# EAGLE design RotaryEncoder (EAGLE 7.2.0)
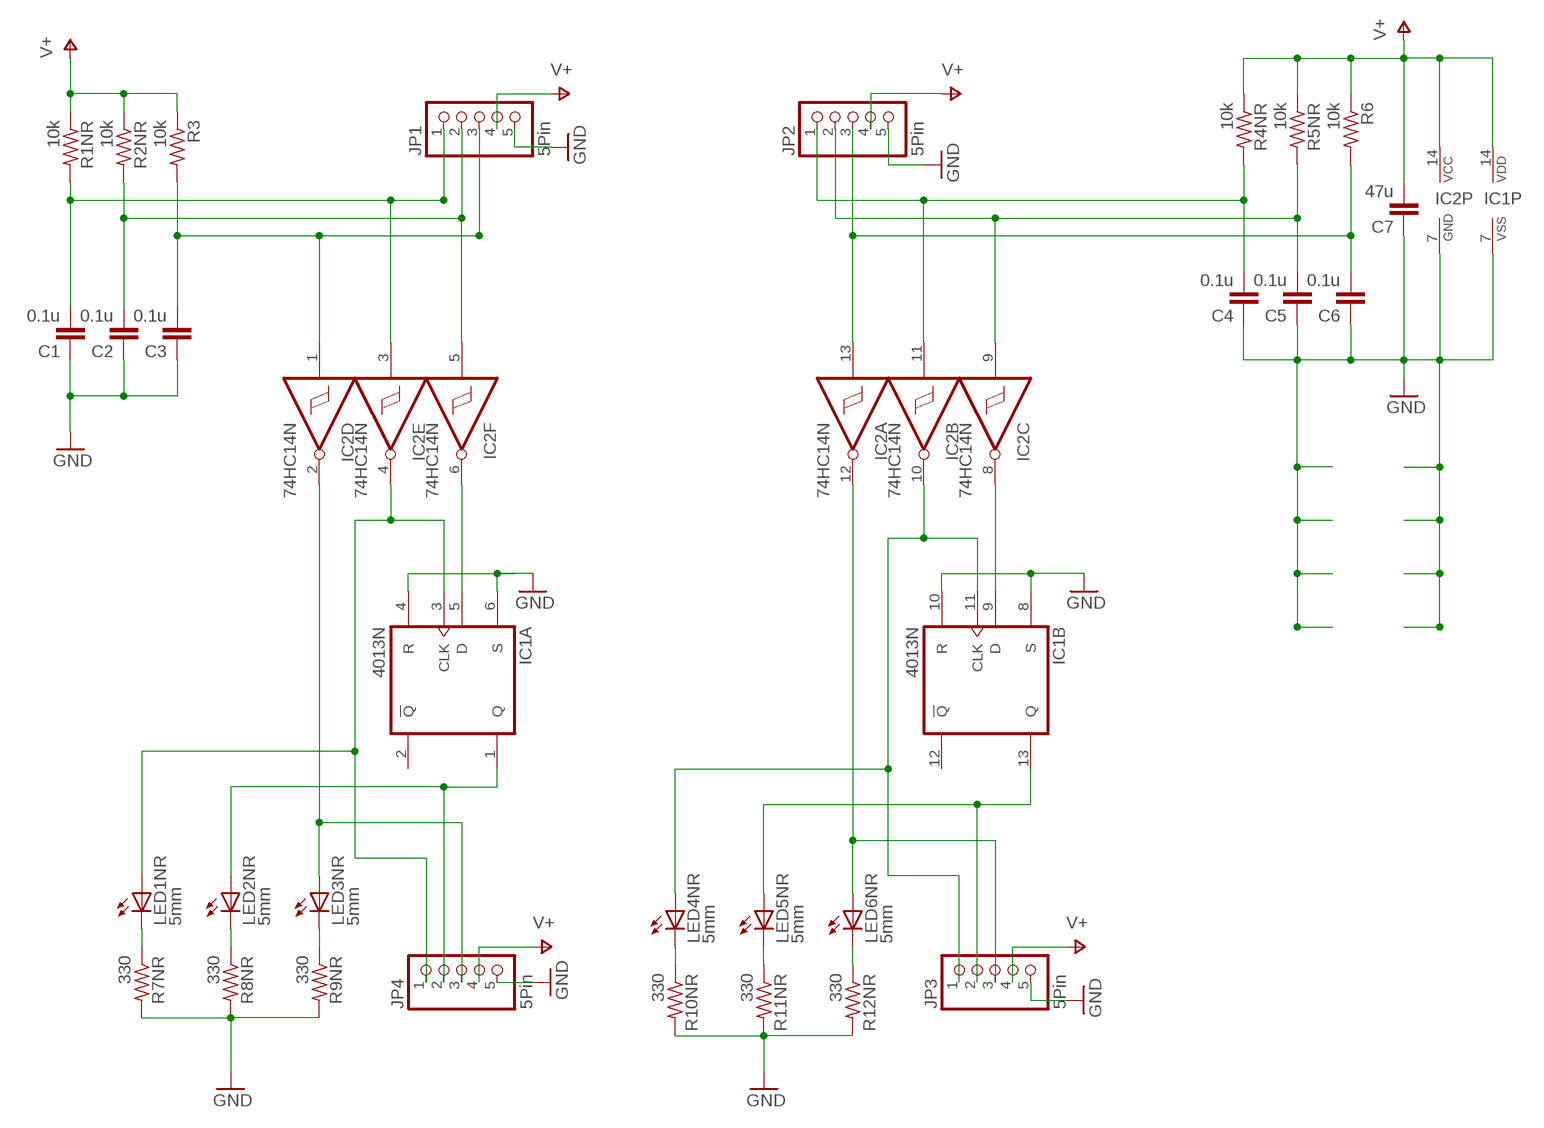
[diagram p0: schematic, sheet 1]

## Parts
C1  0.1u  C7.5/3  [C7.5B3]
C2  0.1u  C7.5/3  [C7.5B3]
C3  0.1u  C7.5/3  [C7.5B3]
C4  0.1u  C7.5/3  [C7.5B3]
C5  0.1u  C7.5/3  [C7.5B3]
C6  0.1u  C7.5/3  [C7.5B3]
C7  47u  C7.5/3  [C7.5B3]
IC1  4013N  [DIL14]
IC2  74HC14N  [DIL14]
JP1  5Pin  PINHD-1X5  [1X05]
JP2  5Pin  PINHD-1X5  [1X05]
JP3  5Pin  PINHD-1X5  [1X05]
JP4  5Pin  PINHD-1X5  [1X05]
LED1NR  5mm  LED5MM  [LED5MM]
LED2NR  5mm  LED5MM  [LED5MM]
LED3NR  5mm  LED5MM  [LED5MM]
LED4NR  5mm  LED5MM  [LED5MM]
LED5NR  5mm  LED5MM  [LED5MM]
LED6NR  5mm  LED5MM  [LED5MM]
R1NR  10k  R-US_0411/15  [0411/15]
R2NR  10k  R-US_0411/15  [0411/15]
R3  10k  R-US_0411/15  [0411/15]
R4NR  10k  R-US_0411/15  [0411/15]
R5NR  10k  R-US_0411/15  [0411/15]
R6  10k  R-US_0411/15  [0411/15]
R7NR  330  R-US_0411/15  [0411/15]
R8NR  330  R-US_0411/15  [0411/15]
R9NR  330  R-US_0411/15  [0411/15]
R10NR  330  R-US_0411/15  [0411/15]
R11NR  330  R-US_0411/15  [0411/15]
R12NR  330  R-US_0411/15  [0411/15]

## Nets
GND: C1.1 C2.1 C3.1 C4.1 C5.1 C6.1 C7.1 IC1.4(A:R) IC1.6(A:S) IC1.7(P:VSS) IC1.8(B:S) IC1.10(B:R) IC2.7(P:GND) JP1.5 JP2.5 JP3.5 JP4.5 R7NR.2 R8NR.2 R9NR.2 R10NR.2 R11NR.2 R12NR.2
N$1: C4.2 IC2.11(B:I) JP2.1 R4NR.2
N$2: C1.2 IC2.3(E:I) JP1.1 R1NR.2
N$3: C2.2 IC2.5(F:I) JP1.2 R2NR.2
N$4: C3.2 IC2.1(D:I) JP1.3 R3.2
N$5: LED1NR.K(C) R7NR.1
N$6: IC2.12(A:O) JP3.3 LED6NR.A
N$7: C6.2 IC2.13(A:I) JP2.3 R6.2
N$8: C5.2 IC2.9(C:I) JP2.2 R5NR.2
N$9: IC1.5(A:D) IC2.6(F:O)
N$10: IC2.2(D:O) JP4.3 LED3NR.A
N$11: IC1.1(A:Q) JP4.2 LED2NR.A
N$12: IC1.3(A:CLK) IC2.4(E:O) JP4.1 LED1NR.A
N$13: LED2NR.K(C) R8NR.1
N$14: LED3NR.K(C) R9NR.1
N$15: LED4NR.K(C) R10NR.1
N$16: IC1.13(B:Q) JP3.2 LED5NR.A
N$17: IC1.11(B:CLK) IC2.10(B:O) JP3.1 LED4NR.A
N$18: IC1.9(B:D) IC2.8(C:O)
N$21: LED6NR.K(C) R12NR.1
N$22: LED5NR.K(C) R11NR.1
V+: C7.2 IC1.14(P:VDD) IC2.14(P:VCC) JP1.4 JP2.4 JP3.4 JP4.4 R1NR.1 R2NR.1 R3.1 R4NR.1 R5NR.1 R6.1
Unconnected: IC1.2(A:!Q) IC1.12(B:!Q)

## Library data of the parts
C1-C7 = capacitor-wima:C: CAPACITOR naming: grid - package width
IC1 = 40xx:4013: Dual D FLIP FLOP, set/reset
IC2 = 74xx-eu:74*14: Hex schmitt trigger INVERTER
JP1-JP4 = pinhead:PINHD-1X5: PIN HEADER
LED1NR LED2NR LED3NR LED4NR LED5NR LED6NR = led:LED: LED OSRAM: - CHIPLED LG R971, LG N971, LY N971, LG Q971, LY Q971, LO R971, LY R971 LH N974, LH R974 LS Q976, LO Q976, LY Q976 LO Q996 - Hyper CHIPLED LW Q18S LB Q993, LB Q99A, LB R99A - SideLED LS A670, LO A670, LY A670, LG A670, LP A670 LB A673, LV A673, LT A673, LW A673 LH A674 LY A675 LS A676, LA A676, LO A676, LY A676, LW A676 LS A679, LY A679, LG A679 - Hyper Micro SIDELED® LS Y876, LA Y876, LO Y876, LY Y876 LT Y87S - SmartLED LW L88C, LW L88S LB L89C, LB L89S, LG L890 LS L89K, LO L89K, LY L89K LS L896, LA L896, LO L896, LY L896 - TOPLED LS T670, LO T670, LY T670, LG T670, LP T670 LSG T670, LSP T670, LSY T670, LOP T670, LYG T670 LG T671, LOG T671, LSG T671 LB T673, LV T673, LT T673, LW T673 LH T674 LS T676, LA T676, LO T676, LY T676, LB T676, LH T676, LSB T676, LW T676 LB T67C, LV T67C, LT T67C, LS T67K, LO T67K, LY T67K, LW E67C LS E67B, LA E67B, LO E67B, LY E67B, LB E67C, LV E67C, LT E67C LW T67C LS T679, LY T679, LG T679 LS T770, LO T770, LY T770, LG T770, LP T770 LB T773, LV T773, LT T773, LW T773 LH T774 LS E675, LA E675, LY E675, LS T675 LS T776, LA T776, LO T776, LY T776, LB T776 LHGB T686 LT T68C, LB T68C - Hyper Mini TOPLED® LB M676 - Mini TOPLED Santana® LG M470 LS M47K, LO M47K, LY M47K Source: http://www.osram.convergy.de LUXEON: - LUMILED® LXK2-PW12-R00, LXK2-PW12-S00, LXK2-PW14-U00, LXK2-PW14-V00 LXK2-PM12-R00, LXK2-PM12-S00, LXK2-PM14-U00 LXK2-PE12-Q00, LXK2-PE12-R00, LXK2-PE12-S00, LXK2-PE14-T00, LXK2-PE14-U00 LXK2-PB12-K00, LXK2-PB12-L00, LXK2-PB12-M00, LXK2-PB14-N00, LXK2-PB14-P00, LXK2-PB14-Q00 LXK2-PR12-L00, LXK2-PR12-M00, LXK2-PR14-Q00, LXK2-PR14-R00 LXK2-PD12-Q00, LXK2-PD12-R00, LXK2-PD12-S00 LXK2-PH12-R00, LXK2-PH12-S00 LXK2-PL12-P00, LXK2-PL12-Q00, LXK2-PL12-R00 Source: www.luxeon.com KINGBRIGHT: KA-3528ASYC Source: www.kingbright.com
R1NR R2NR R3 R4NR R5NR R6 R7NR R8NR R9NR R10NR R11NR R12NR = resistor:R-US_: RESISTOR, American symbol

## Board
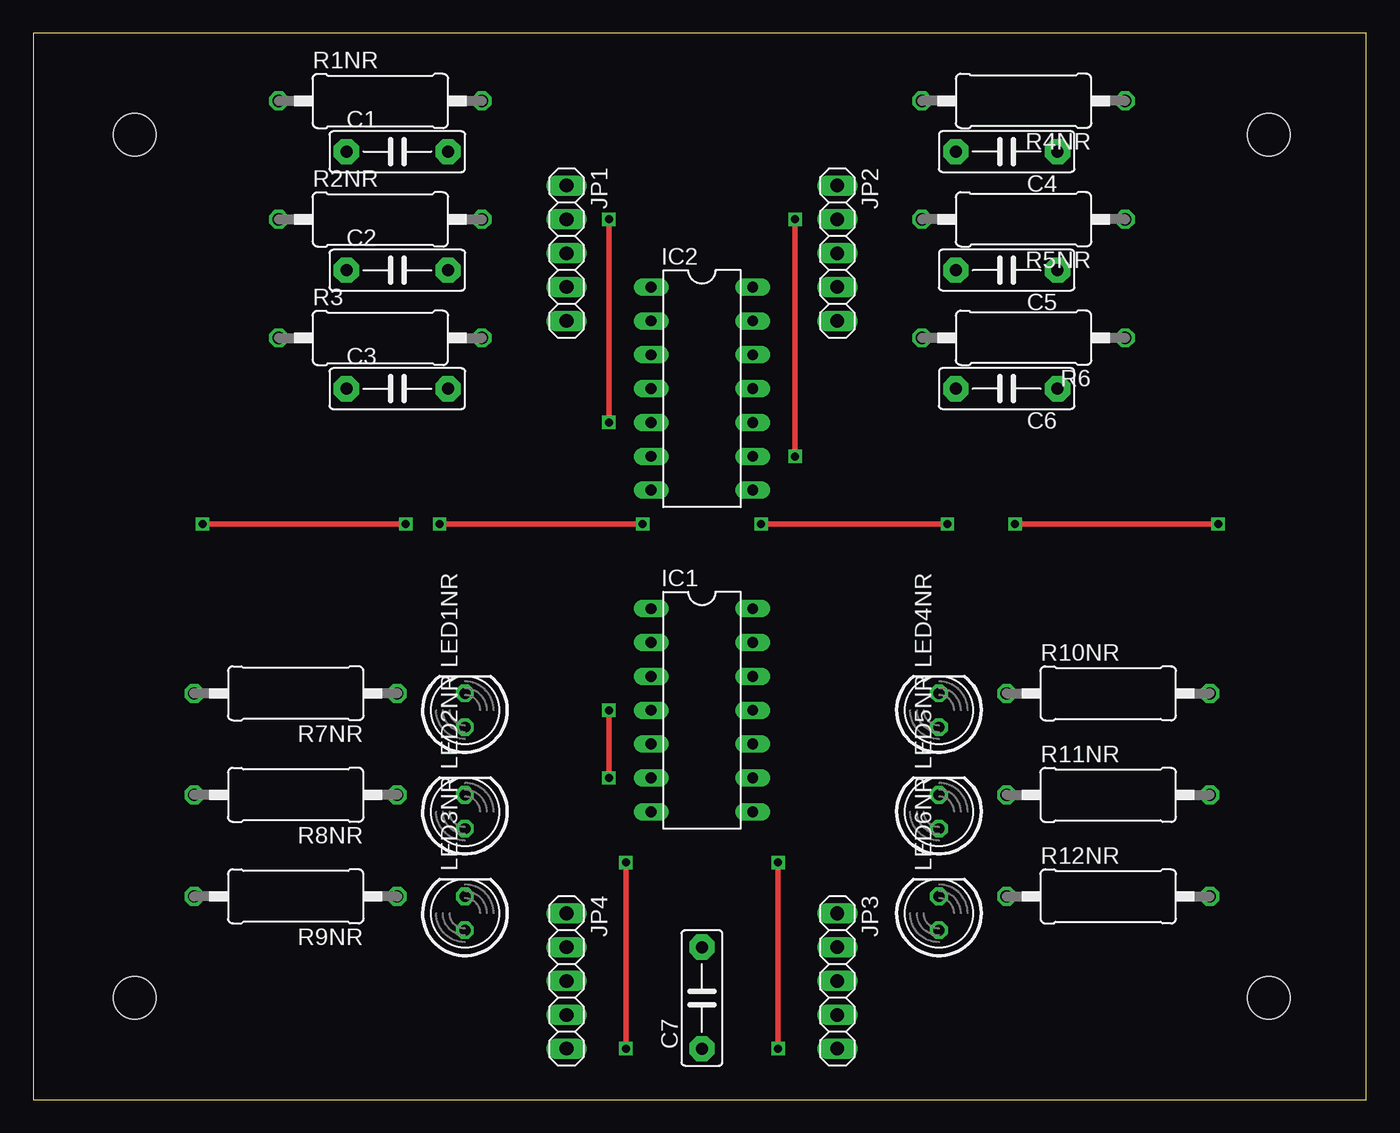
[diagram p1: board, top side]
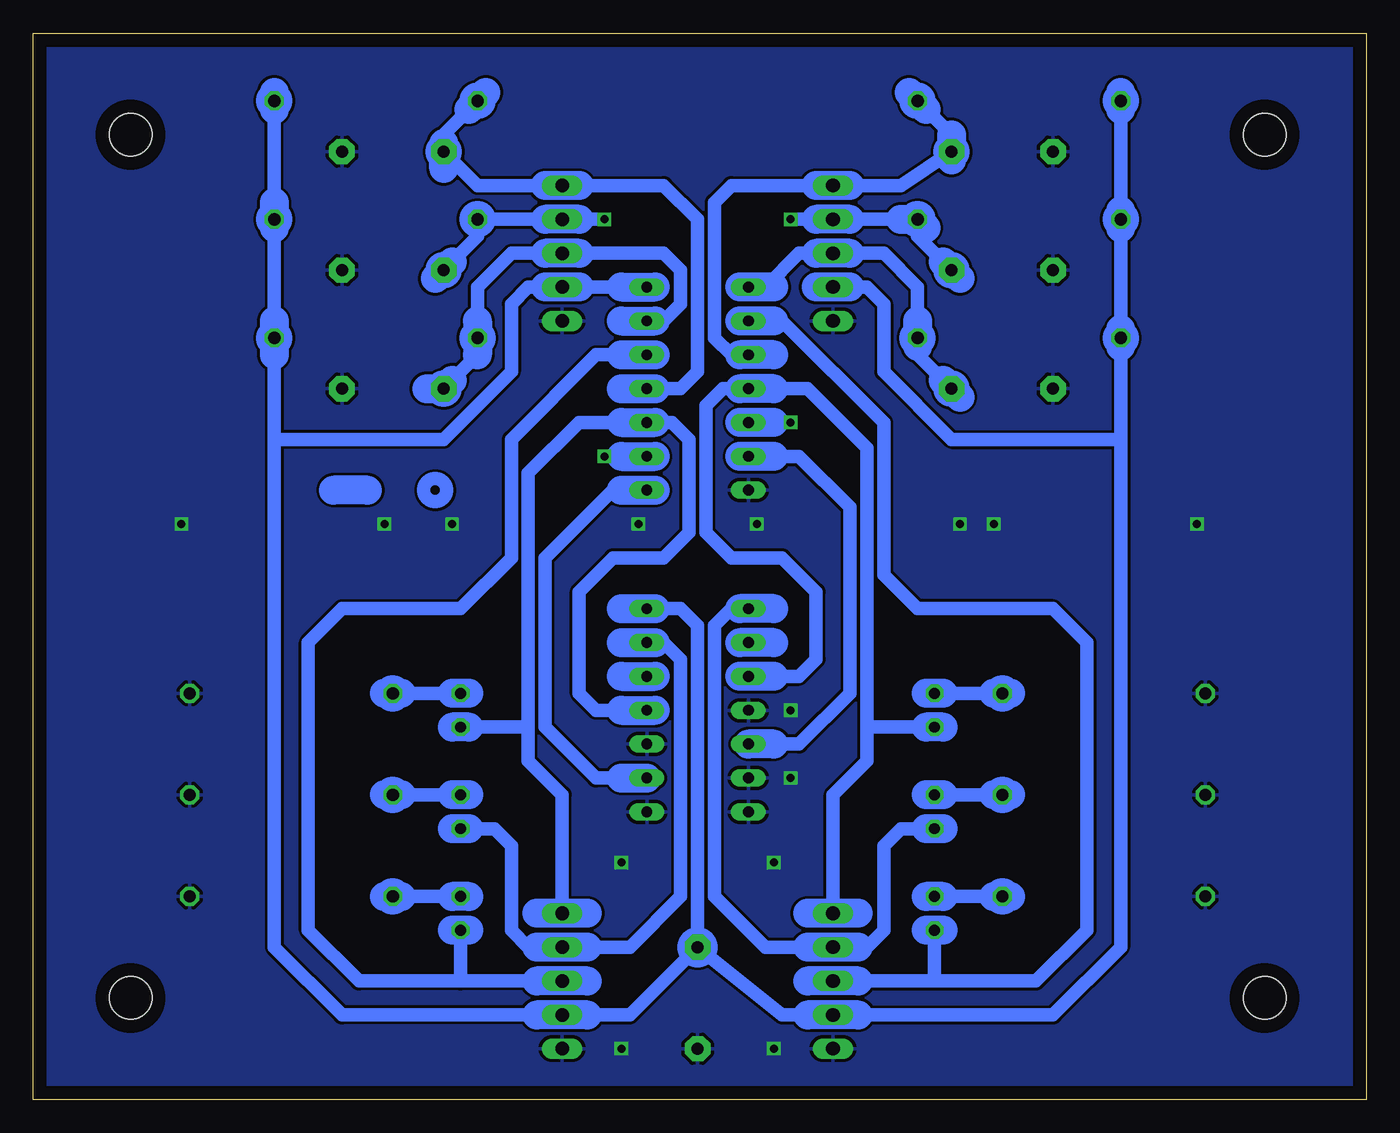
[diagram p2: board, bottom side, seen from below]

Size 100 x 80 mm. Coordinates in mm from the lower left corner, seen from the top.
Outline: 0,0 100,0 100,80 0,80 0,0
Copper layers (1*16): Top 0.035mm / dielectric 1.5mm / Bottom 0.035mm
Design rules "default": minimum track width 10mil, minimum drill 24mil, track to track 8mil, track to pad 8mil, pad to pad 8mil, via to via 8mil, smd to smd 8mil, copper to edge 40mil, drill to drill 8mil, minimum pad ring 10mil, minimum via ring 8mil, stop-mask expansion 4mil, vias tented up to drill 0mil, thermal gap 10mil
Holes 3.2 mm at 7.62,72.39 92.71,72.39 92.71,7.62 7.62,7.62

### Footprints (pad centres in the part's own frame; a part is rotated, then mirrored left to right if it is on the bottom)
C7.5B3 = drill 0.914 pad 1.905 octagon: 1 -3.81,0; 2 3.81,0
DIL14 = drill 0.813 long: 1 -7.62,-3.81; 2 -5.08,-3.81; 3 -2.54,-3.81; 4 0,-3.81; 5 2.54,-3.81; 6 5.08,-3.81; 7 7.62,-3.81; 8 7.62,3.81; 9 5.08,3.81; 10 2.54,3.81; 11 0,3.81; 12 -2.54,3.81; 13 -5.08,3.81; 14 -7.62,3.81
1X05 = drill 1.016 long: 1 -5.08,0; 2 -2.54,0; 3 0,0; 4 2.54,0; 5 5.08,0
LED5MM = drill 0.813 octagon: A -1.27,0; K 1.27,0
0411/15 = drill 0.914 octagon: 1 -7.62,0; 2 7.62,0

### Placement (x,y rotation side)
C1  27.3,71.12 0 top
C2  27.3,62.23 0 top
C3  27.3,53.34 0 top
C4  73.03,71.12 180 top
C5  73.03,62.23 180 top
C6  73.03,53.34 180 top
C7  50.16,7.62 90 top
IC1  50.16,29.21 270 top
IC2  50.16,53.34 270 top
JP1  40.01,63.5 270 top
JP2  60.33,63.5 270 top
JP3  60.33,8.89 270 top
JP4  40.01,8.89 270 top
LED1NR  32.38,29.21 90 top
LED2NR  32.38,21.59 90 top
LED3NR  32.38,13.97 90 top
LED4NR  67.94,29.21 90 top
LED5NR  67.94,21.59 90 top
LED6NR  67.94,13.97 90 top
R1NR  26.04,74.93 0 top
R2NR  26.04,66.04 0 top
R3  26.04,57.15 0 top
R4NR  74.3,74.93 180 top
R5NR  74.3,66.04 180 top
R6  74.3,57.15 180 top
R7NR  19.68,30.48 180 top
R8NR  19.68,22.86 180 top
R9NR  19.68,15.24 180 top
R10NR  80.64,30.48 0 top
R11NR  80.64,22.86 0 top
R12NR  80.64,15.24 0 top

### Tracks (layer width: path | path; a pad name or v marks a point on that pad's centre or on a via)
GND  (via drill 0.6)
  Top 0.406: v44.45,17.78 v44.45,3.81 | v55.88,17.78 v55.88,3.81 | v12.7,43.18 v27.94,43.18 | v30.48,43.18 v45.72,43.18 | v43.18,29.21 v43.18,24.13 | v54.61,43.18 v68.58,43.18 | v73.66,43.18 v88.9,43.18
  pour Bottom: 0,0 0,80.01 100.33,80.01 100.33,0
N$1
  Bottom 1.016: IC2.11 53.34,53.34 51.44,53.34 50.16,54.61 50.16,66.04 52.7,68.58 59.05,68.58 JP2.1 61.59,68.58 66.67,68.58 C4.2 69.22,71.75 69.22,72.39 67.31,74.3 R4NR.2
  Bottom 2.184: 55.88,53.34 53.34,53.34 | 69.22,69.85 69.22,71.75 | 66.04,75.56 67.31,74.3 | 59.05,68.58 61.59,68.58
N$2
  Bottom 1.016: IC2.3 46.99,55.88 47.62,55.88 48.9,57.15 48.9,67.31 47.62,68.58 41.27,68.58 JP1.1 38.73,68.58 34.92,68.58 C1.2 31.11,72.39 33.02,74.3 R1NR.2
  Bottom 2.184: 44.45,55.88 46.99,55.88 | 38.73,68.58 41.27,68.58 | 34.29,75.56 33.02,74.3 | 31.11,72.39 31.11,70.48
N$3  (via drill 0.6)
  Top 0.406: v43.18,66.04 v43.18,50.8
  Bottom 1.016: v43.18,66.04 41.27,66.04 JP1.2 38.73,66.04 34.92,66.04 | v43.18,50.8 44.45,50.8 IC2.5 | C2.2 31.75,62.87 33.66,64.77 R2NR.2
  Bottom 2.184: 44.45,50.8 46.99,50.8 | 38.73,66.04 41.27,66.04 | 34.92,66.04 R2NR.2 33.02,65.41 | 30.48,61.59 31.75,62.87
N$4
  Bottom 1.016: IC2.1 45.09,60.96 42.55,63.5 41.27,63.5 JP1.3 38.73,63.5 36.2,63.5 33.66,60.96 33.66,58.42 R3.2 33.66,56.52 33.66,55.88 31.75,53.98 C3.2
  Bottom 2.184: 38.73,63.5 41.27,63.5 | 33.66,58.42 33.66,56.52 | 30.48,52.7 31.75,53.98
N$5
  Bottom 1.016: R7NR.1 27.94,30.48 31.75,30.48 LED1NR.K
  Bottom 2.184: 31.75,30.48 33.02,30.48 | 26.67,30.48 27.94,30.48
N$6
  Bottom 1.016: JP3.3 62.23,8.89 67.94,8.89 | 67.94,8.89 75.56,8.89 79.38,12.7 79.38,34.29 76.83,36.83 67.94,36.83 64.14,40.64 64.14,49.53 57.78,55.88 55.88,55.88 IC2.12 | LED6NR.A 67.94,8.89
  Bottom 2.184: 55.88,55.88 53.34,55.88 | 58.42,8.89 62.23,8.89
N$7
  Bottom 1.016: IC2.13 53.34,58.42 52.7,58.42 51.44,59.69 51.44,62.23 52.7,63.5 59.05,63.5 JP2.3 61.59,63.5 64.14,63.5 66.67,60.96 66.67,58.42 R6.2 66.67,55.88 68.58,53.98
  Bottom 2.184: 55.88,58.42 53.34,58.42 | 66.67,58.42 66.67,55.88 | 70.48,53.34 C6.2 68.58,53.98 | 59.05,63.5 61.59,63.5
N$8  (via drill 0.6)
  Top 0.406: v57.15,66.04 v57.15,48.26
  Bottom 1.016: C5.2 68.58,62.87 66.67,64.77 R5NR.2 61.59,66.04 JP2.2 59.05,66.04 v57.15,66.04 | v57.15,48.26 55.88,48.26 IC2.9
  Bottom 2.184: 55.88,48.26 53.34,48.26 | 69.85,61.59 68.58,62.87 | 59.05,66.04 61.59,66.04
N$9
  Bottom 1.016: IC2.6 44.45,48.26 42.55,48.26 38.73,44.45 38.73,30.48 42.55,26.67 44.45,26.67
  Bottom 2.184: 44.45,48.26 46.99,48.26 | 44.45,26.67 IC1.5
N$10
  Bottom 1.016: IC2.2 44.45,58.42 43.81,58.42 36.2,50.8 36.2,39.37 33.66,36.83 23.5,36.83 20.95,34.29 20.95,12.7 24.77,8.89 32.38,8.89 | JP4.3 38.1,8.89 32.38,8.89 | LED3NR.A 32.38,8.89
  Bottom 2.184: 44.45,58.42 46.99,58.42 | 38.1,8.89 41.91,8.89
N$11
  Bottom 1.016: IC1.1 46.99,36.83 47.62,36.83 48.9,35.56 48.9,15.24 45.09,11.43 41.91,11.43 JP4.2 38.1,11.43 37.47,11.43 36.2,12.7 36.2,19.05 34.92,20.32 33.02,20.32 LED2NR.A
  Bottom 2.184: 44.45,36.83 46.99,36.83 | 38.1,11.43 41.91,11.43 | 31.75,20.32 33.02,20.32
N$12
  Bottom 1.016: IC1.3 44.45,31.75 42.55,31.75 41.27,33.02 41.27,38.1 43.81,40.64 47.62,40.64 49.53,42.55 49.53,52.07 48.26,53.34 46.99,53.34 IC2.4 44.45,53.34 41.91,53.34 37.47,48.9 37.47,27.94 | LED1NR.A 33.02,27.94 37.47,27.94 | JP4.1 40.01,22.86 37.47,25.4 37.47,27.94
  Bottom 2.184: 44.45,53.34 46.99,53.34 | 44.45,31.75 46.99,31.75 | 31.75,27.94 33.02,27.94
N$13
  Bottom 1.016: R8NR.1 27.94,22.86 31.75,22.86 LED2NR.K
  Bottom 2.184: 31.75,22.86 33.02,22.86 | 26.67,22.86 27.94,22.86
N$14
  Bottom 1.016: R9NR.1 27.94,15.24 31.75,15.24 LED3NR.K
  Bottom 2.184: 31.75,15.24 33.02,15.24 | 26.67,15.24 27.94,15.24
N$15
  Bottom 1.016: LED4NR.K 68.58,30.48 72.39,30.48 R10NR.1
  Bottom 2.184: 67.31,30.48 68.58,30.48 | 72.39,30.48 73.66,30.48
N$16
  Bottom 1.016: IC1.13 53.34,34.29 52.7,34.29 51.44,33.02 51.44,15.24 55.24,11.43 58.42,11.43 JP3.2 62.23,11.43 62.87,11.43 64.14,12.7 64.14,19.05 65.41,20.32 67.31,20.32 LED5NR.A
  Bottom 2.184: 55.88,34.29 53.34,34.29 | 58.42,11.43 62.23,11.43 | 67.31,20.32 68.58,20.32
N$17
  Bottom 1.016: IC1.11 57.78,29.21 59.05,30.48 59.05,38.1 56.52,40.64 52.7,40.64 50.8,42.55 50.8,49.53 52.07,50.8 53.34,50.8 IC2.10 55.88,50.8 59.05,50.8 62.87,46.99 62.87,27.94 | LED4NR.A 67.31,27.94 62.87,27.94 | JP3.1 60.33,22.86 62.87,25.4 62.87,27.94
  Bottom 2.184: 55.88,50.8 53.34,50.8 | 67.31,27.94 68.58,27.94
N$18
  Bottom 1.016: 55.88,24.13 57.78,24.13 61.59,27.94 61.59,40.64 56.52,45.72 55.88,45.72 IC2.8
  Bottom 2.184: 55.88,45.72 53.34,45.72 | 55.88,24.13 IC1.9
N$19
  Bottom 2.184: 74.93,45.72 77.47,45.72
N$20
  Bottom 2.184: 44.45,60.96 46.99,60.96
N$21
  Bottom 1.016: LED6NR.K 68.58,15.24 72.39,15.24 R12NR.1
  Bottom 2.184: 67.31,15.24 68.58,15.24 | 72.39,15.24 73.66,15.24
N$22
  Bottom 1.016: R11NR.1 72.39,22.86 68.58,22.86 LED5NR.K
  Bottom 2.184: 67.31,22.86 68.58,22.86 | 72.39,22.86 73.66,22.86
N$23
  Bottom 2.184: 44.45,34.29 46.99,34.29
N$24
  Bottom 2.184: 55.88,29.21 53.34,29.21
N$25
  Bottom 2.184: 55.88,31.75 53.34,31.75
N$26
  Bottom 2.184: 38.1,13.97 41.91,13.97
N$27
  Bottom 2.184: 58.42,13.97 62.23,13.97
N$28
  Bottom 2.184: 67.31,12.7 68.58,12.7
N$29
  Bottom 2.184: 31.75,12.7 33.02,12.7
V+
  Bottom 1.016: C7.2 55.24,6.35 58.42,6.35 JP3.4 62.23,6.35 76.83,6.35 81.92,11.43 81.92,49.53 | C7.2 43.81,6.35 41.91,6.35 JP4.4 38.1,6.35 23.5,6.35 18.41,11.43 18.41,49.53 | C7.2 50.16,35.56 51.44,36.83 53.34,36.83 IC1.14 | IC2.14 55.88,60.96 59.05,60.96 JP2.4 61.59,60.96 62.87,60.96 64.14,59.69 64.14,54.61 69.22,49.53 81.92,49.53 | R4NR.1 81.92,74.3 81.92,67.31 R5NR.1 81.92,65.41 81.92,58.42 R6.1 81.92,55.88 81.92,49.53 | 18.41,49.53 18.41,56.52 R3.1 18.41,57.78 18.41,65.41 R2NR.1 18.41,66.67 18.41,74.3 R1NR.1 | 18.41,49.53 31.11,49.53 36.2,54.61 36.2,59.69 37.47,60.96 38.73,60.96 JP1.4
  Bottom 2.184: 55.88,60.96 53.34,60.96 | 55.88,36.83 53.34,36.83 | 38.1,6.35 41.91,6.35 | 58.42,6.35 62.23,6.35 | 81.92,75.56 81.92,74.3 | 81.92,67.31 81.92,65.41 | 81.92,58.42 81.92,55.88 | 59.05,60.96 61.59,60.96 | 38.73,60.96 41.27,60.96 | 18.41,75.56 18.41,74.3 | 18.41,66.67 18.41,65.41 | 18.41,57.78 18.41,56.52
(copper drawn outside any net)
  shapes: Bottom circle x27